# Altium schematic sheet micro.SchDoc
size A4
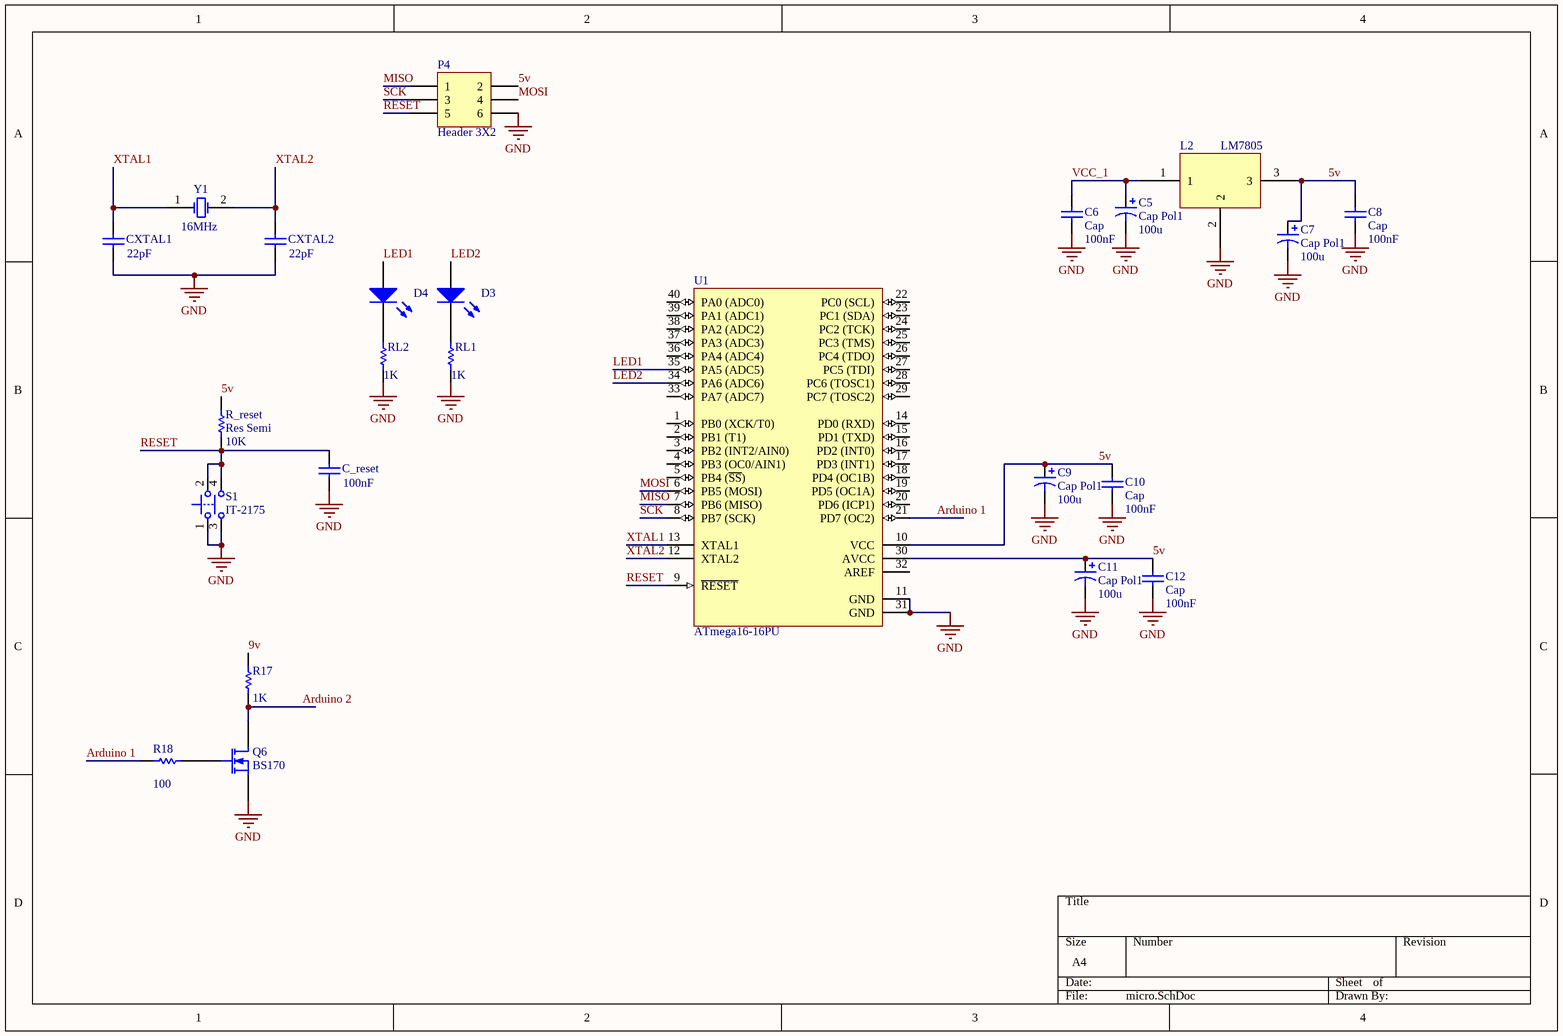
[diagram p0: micro.SchDoc]

## Parts
C5  Cap Pol1  value 100u  [A]
C6  Cap  value 100nF  [C1206]
C7  Cap Pol1  value 100u  [A]
C8  Cap  value 100nF  [C1206]
C9  Cap Pol1  value 100u  [A]
C10  Cap  value 100nF  [C1206]
C11  Cap Pol1  value 100u  [A]
C12  Cap  value 100nF  [C1206]
C_reset  value 100nF  [C1206]  (hidden comment: Ci)
CXTAL1  value 22pF  [C1206]  (hidden comment: Ci)
CXTAL2  value 22pF  [C1206]  (hidden comment: Ci)
D3  LED3  [LED Blue 3mm TH V]  (value not drawn)
D4  LED3  [LED Blue 3mm TH V]  (value not drawn)
L2  LM7805  [TO-220AB]
P4  Header 3X2  [HDR2X3]
Q6  BS170  [E3]
R17  value 1K  [3216[1206]]  (hidden comment: Res Semi)
R18  value 100  [3216[1206]]  (hidden comment: Res Semi)
R_reset  Res Semi  value 10K  [3216[1206]]
RL1  value 1K  [3216[1206]]  (hidden comment: Res Semi)
RL2  value 1K  [3216[1206]]  (hidden comment: Res Semi)
S1  IT-2175  [IT-2175]
U1  ATmega16-16PU  [40P6]
Y1  16MHz  [R38]

## Nets
GND: C5.2 C6.1 C7.2 C8.1 C9.2 C10.1 C11.2 C12.1 C_reset.1 CXTAL1.1 CXTAL2.1 L2.2 P4.6 Q6.3(S) RL1.1 RL2.1 S1.1 S1.3 U1.11(GND) U1.31(GND)
5v: C7.1 C8.2 C9.1 C10.2 C11.1 C12.2 L2.3 P4.2 R_reset.2 U1.10(VCC) U1.30(AVCC)
9v: R17.2
Arduino 1: R18.2 U1.21(PD7_(OC2))
Arduino 2: Q6.1(D) R17.1
LED1: D4.1(A) U1.35(PA5_(ADC5))
LED2: D3.1(A) U1.34(PA6_(ADC6))
MISO: P4.1 U1.7(PB6_(MISO))
MOSI: P4.4 U1.6(PB5_(MOSI))
RESET: C_reset.2 P4.5 R_reset.1 S1.2 S1.4 U1.9(~{RESET})
SCK: P4.3 U1.8(PB7_(SCK))
VCC_1: C5.1 C6.2 L2.1
XTAL1: CXTAL1.2 U1.13(XTAL1) Y1.1(OSC1)
XTAL2: CXTAL2.2 U1.12(XTAL2) Y1.2(OSC2)
NetD3_2: D3.2(K) RL1.2
NetD4_2: D4.2(K) RL2.2
NetQ6_2: Q6.2(G) R18.1

Not connected (* = marked no-connect by the designer): U1 1(PB0_(XCK/T0)) 2(PB1_(T1)) 3(PB2_(INT2/AIN0)) 4(PB3_(OC0/AIN1)) 5(PB4_(~{SS})) 14(PD0_(RXD)) 15(PD1_(TXD)) 16(PD2_(INT0)) 17(PD3_(INT1)) 18(PD4_(OC1B)) 19(PD5_(OC1A)) 20(PD6_(ICP1)) 22(PC0_(SCL)) 23(PC1_(SDA)) 24(PC2_(TCK)) 25(PC3_(TMS)) 26(PC4_(TDO)) 27(PC5_(TDI)) 28(PC6_(TOSC1)) 29(PC7_(TOSC2)) 32(AREF) 33(PA7_(ADC7)) 36(PA4_(ADC4)) 37(PA3_(ADC3)) 38(PA2_(ADC2)) 39(PA1_(ADC1)) 40(PA0_(ADC0))

## Library data of the parts
C5 C7 C9 C11 = Cap Pol1: Polarized Capacitor (Radial); Published: 8-Jun-2000; LatestRevisionDate: 17-Jul-2002; LatestRevisionNote: Re-released for DXP Platform.; PackageReference: RB7.6-15; Publisher: Altium Limited
C6 C8 C10 C12 = Cap: Capacitor; Published: 8-Jun-2000; LatestRevisionDate: 17-Jul-2002; LatestRevisionNote: Re-released for DXP Platform.; PackageReference: RAD-0.3; Publisher: Altium Limited
C_reset CXTAL1 CXTAL2 = Cap Semi: Capacitor (Semiconductor SIM Model); Published: 8-Jun-2000; LatestRevisionDate: 17-Jul-2002; LatestRevisionNote: Re-released for DXP Platform.; PackageReference: C1206; Publisher: Altium Limited
D3 D4 = LED3: Typical BLUE SiC LED; Published: 8-Jun-2000; LatestRevisionDate: 17-Dec-2003; LatestRevisionNote: PCB Footprint replaced.; DatasheetDocument: 16-Apr-2002; PackageDocument: 16-Apr-2002; PackageReference: 3.5X2.8X1.9; Publisher: Altium Limited
L2 = LM7809
P4 = Header 3X2: Header, 3-Pin, Dual row; LatestRevisionDate: 17-Jul-2002; LatestRevisionNote: Re-released for DXP Platform.; Publisher: Altium Limited
Q6 = MOSFET-N: N-Channel MOSFET; PackageDocument: 1995/1996; Published: 8-Jun-2000; LatestRevisionDate: 17-Jul-2002; LatestRevisionNote: Re-released for DXP Platform.; PackageReference: E3; Publisher: Altium Limited
R17 R18 R_reset RL1 RL2 = Res Semi: Semiconductor Resistor; Published: 8-Jun-2000; LatestRevisionDate: 17-Jul-2002; LatestRevisionNote: Re-released for DXP Platform.; PackageReference: AXIAL-0.5; Publisher: Altium Limited
S1 = IT-2175: Tactile Switch, DPST; Thru-Hole; Vertical; Rating DC 12V, 50mA (max); PackageDocument: Rev.0; Published: 6-Jun-2005; DatasheetDocument: Rev.0; PackageReference: IT-2175; Publisher: Altium Limited; ComponentLink1Description: Manufacturer Link; ComponentLink1URL: http://www.ilswitch.com/; ComponentLink2Description: Device Overview; ComponentLink2URL: http://www.ilswitch.com/list.php?ac_id=010112&ai_id=91
U1 = ATmega16-16PU: 8-bit AVR Microcontroller, 4.5-5.5V, 16KB Flash, 512 Bytes EEPROM, 1KB SRAM, 40-pin PDIP, Industrial Grade (-40°C to 85°C), Pb-Free; DatasheetVersion: revS, May-2009; PackageVersion: revB, Sep-2001; PackageReference: 40P6; PackageDescription: 40-lead (0.600"/15.24mm Wide) Plastic Dual Inline Package (PDIP); Code_JEDEC: MS-011-AC; ComponentLink1Description: Manufacturer URL; ComponentLink1URL: http://www.atmel.com/; ComponentLink2Description: ATmega16(L)  Datasheet; ComponentLink2URL: http://www.atmel.com/dyn/resources/prod_documents/doc2466.pdf; ComponentLink3Description: ATmega16(L) Summary; ComponentLink3URL: http://www.atmel.com/dyn/resources/prod_documents/2466S.pdf
Y1 = XTAL: Crystal Oscillator; Published: 8-Jun-2000; LatestRevisionDate: 17-Jul-2002; LatestRevisionNote: Re-released for DXP Platform.; PackageReference: R38; Publisher: Altium Limited